# EAGLE design uprom2-2l (EAGLE 9.6.1)
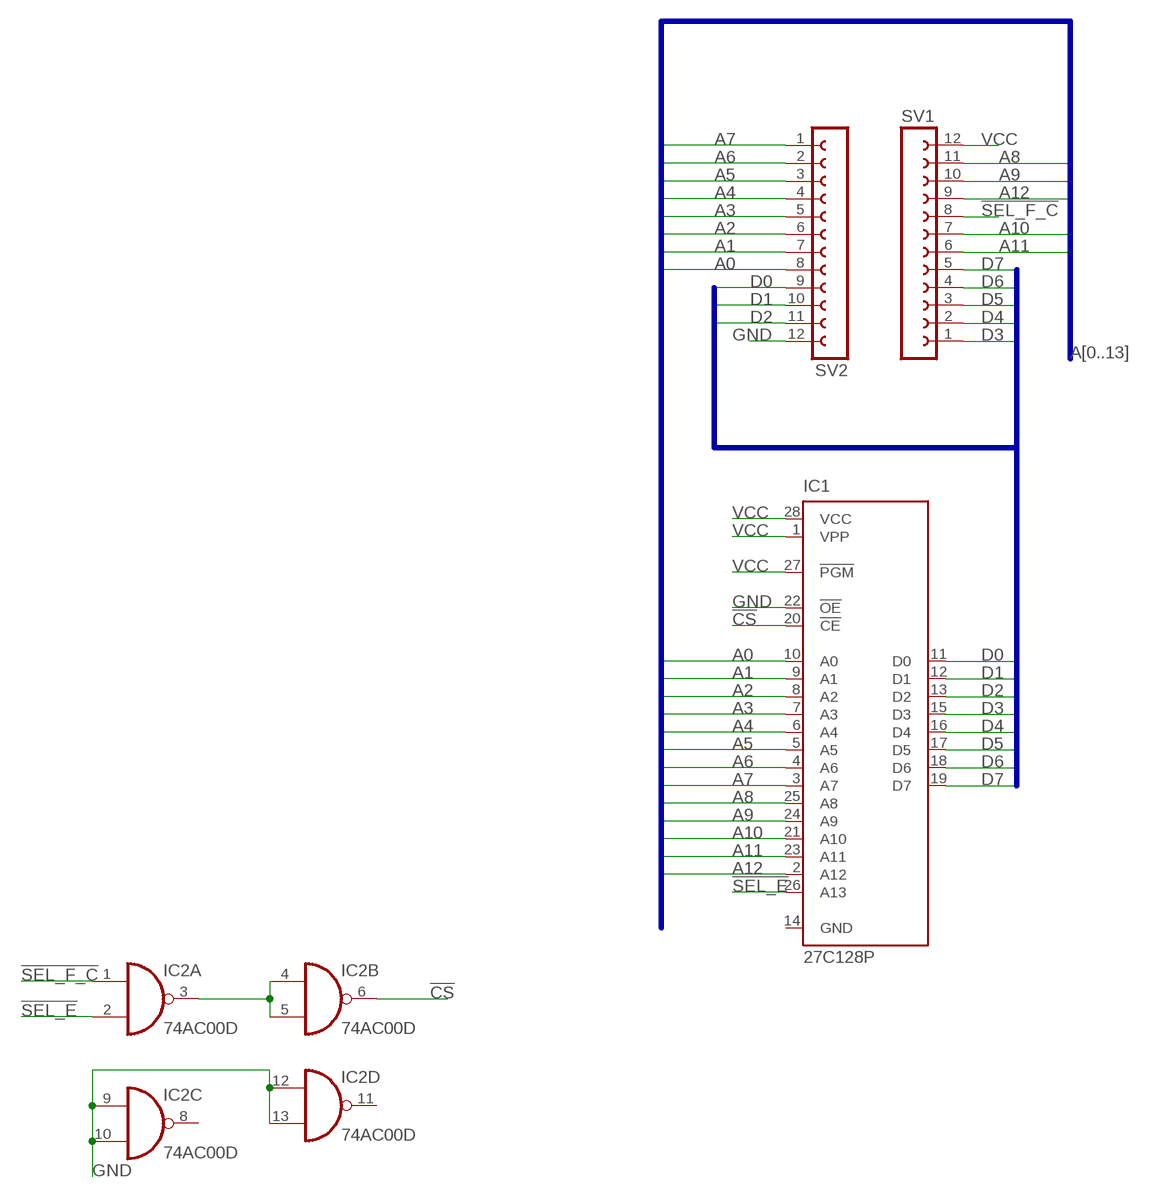
[diagram p0: schematic, sheet 1]

## Parts
IC1  27C128P  [DIL28-6]
IC2  74AC00D  [SO14]
SV1  FE12-1  [FE12]
SV2  FE12-1  [FE12]

## Nets
!CS: IC1.20(!CE) IC2.6(B:O)
!SEL_E: IC1.26(A13) IC2.2(A:I1)
!SEL_F_C: IC2.1(A:I0) SV1.8
A0: IC1.10(A0) SV2.8
A1: IC1.9(A1) SV2.7
A2: IC1.8(A2) SV2.6
A3: IC1.7(A3) SV2.5
A4: IC1.6(A4) SV2.4
A5: IC1.5(A5) SV2.3
A6: IC1.4(A6) SV2.2
A7: IC1.3(A7) SV2.1
A8: IC1.25(A8) SV1.11
A9: IC1.24(A9) SV1.10
A10: IC1.21(A10) SV1.7
A11: IC1.23(A11) SV1.6
A12: IC1.2(A12) SV1.9
D0: IC1.11(D0) SV2.9
D1: IC1.12(D1) SV2.10
D2: IC1.13(D2) SV2.11
D3: IC1.15(D3) SV1.1
D4: IC1.16(D4) SV1.2
D5: IC1.17(D5) SV1.3
D6: IC1.18(D6) SV1.4
D7: IC1.19(D7) SV1.5
GND: IC1.22(!OE) IC2.9(C:I0) IC2.10(C:I1) IC2.12(D:I0) IC2.13(D:I1) SV2.12
N$4: IC2.3(A:O) IC2.4(B:I0) IC2.5(B:I1)
VCC: IC1.1(VPP) IC1.27(!PGM) IC1.28(VCC) SV1.12
Unconnected: IC2.8(C:O) IC2.11(D:O)

## Buses
A[0..13]
D[0..7]

## Power pins joined to a net without a drawn wire
GND: IC1.14(GND) IC2.7(P:GND)
VCC: IC2.14(P:VCC)

## Library data of the parts
IC1 = microchip:27*128: CMOS EPROM 128 K (16 K x 8); OC_FARNELL: unknown; OC_NEWARK: unknown
IC2 = 74xx-eu:74*00: Quad 2-input NAND gate
SV1 SV2 = con-lsta:FE12-1: FEMALE HEADER; OC_FARNELL: unknown; OC_NEWARK: unknown

## Board
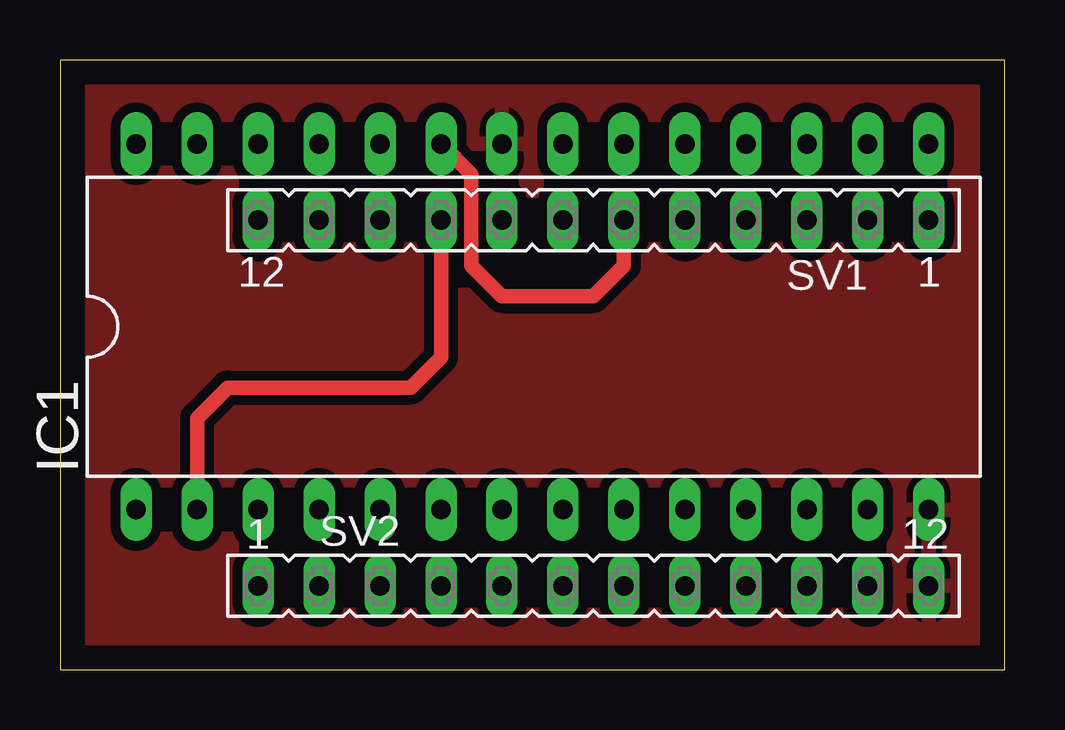
[diagram p1: board, top side]
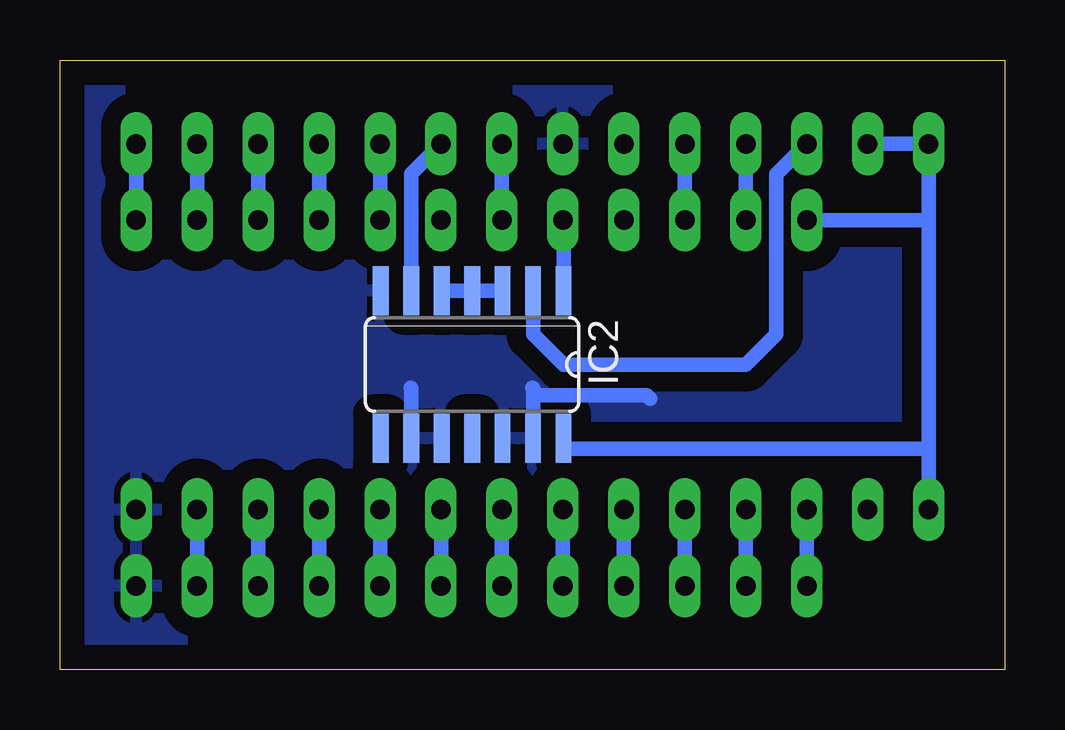
[diagram p2: board, bottom side, seen from below]

Size 39.37 x 25.4 mm. Coordinates in mm from the lower left corner, seen from the top.
Outline: 0,0 39.37,0 39.37,25.4 0,25.4 0,0
Copper layers (1*16): Top 0.035mm / dielectric 1.5mm / Bottom 0.035mm
Design rules "default": minimum track width 6mil, minimum drill 0.35mm, track to track 6mil, track to pad 6mil, pad to pad 6mil, via to via 6mil, smd to smd 6mil, copper to edge 40mil, drill to drill 6mil, minimum pad ring 10mil, minimum via ring 8mil, stop-mask expansion 4mil, vias tented up to drill 0mil, thermal gap 10mil

### Footprints (pad centres in the part's own frame; a part is rotated, then mirrored left to right if it is on the bottom)
DIL28-6 = drill 0.813 long: 1 -16.51,-7.62; 2 -13.97,-7.62; 3 -11.43,-7.62; 4 -8.89,-7.62; 5 -6.35,-7.62; 6 -3.81,-7.62; 7 -1.27,-7.62; 8 1.27,-7.62; 9 3.81,-7.62; 10 6.35,-7.62; 11 8.89,-7.62; 12 11.43,-7.62; 13 13.97,-7.62; 14 16.51,-7.62; 15 16.51,7.62; 16 13.97,7.62; 17 11.43,7.62; 18 8.89,7.62; 19 6.35,7.62; 20 3.81,7.62; 21 1.27,7.62; 22 -1.27,7.62; 23 -3.81,7.62; 24 -6.35,7.62; 25 -8.89,7.62; 26 -11.43,7.62; 27 -13.97,7.62; 28 -16.51,7.62
SO14 = smd 0.66 x 2.032: 1 -3.81,-3.073; 2 -2.54,-3.073; 3 -1.27,-3.073; 4 0,-3.073; 5 1.27,-3.073; 6 2.54,-3.073; 7 3.81,-3.073; 8 3.81,3.073; 9 2.54,3.073; 10 1.27,3.073; 11 0,3.073; 12 -1.27,3.073; 13 -2.54,3.073; 14 -3.81,3.073
FE12 = drill 0.813 long: 1 -13.97,0; 2 -11.43,0; 3 -8.89,0; 4 -6.35,0; 5 -3.81,0; 6 -1.27,0; 7 1.27,0; 8 3.81,0; 9 6.35,0; 10 8.89,0; 11 11.43,0; 12 13.97,0

### Placement (x,y rotation side)
IC1  19.69,14.29 0 top
IC2  22.2,12.71 180 bottom
SV1  22.23,18.73 180 top
SV2  22.23,3.49 0 top

### Tracks (layer width: path | path; a pad name or v marks a point on that pad's centre or on a via)
!CS
  Bottom 0.61: IC2.6 24.74,20.66 IC1.20
!SEL_E
  Bottom 0.61: 19.69,15.76 IC2.2 19.66,13.97 18.39,12.7 10.8,12.7 9.52,13.97 9.52,20.64 IC1.26
!SEL_F_C
  Bottom 0.61: IC2.1 18.39,18.71 SV1.8
A0
  Bottom 0.61: IC1.10 SV2.8
A1
  Bottom 0.61: SV2.7 IC1.9
A2
  Bottom 0.61: IC1.8 SV2.6
A3
  Bottom 0.61: SV2.5 IC1.7
A4
  Bottom 0.61: IC1.6 SV2.4
A5
  Bottom 0.61: SV2.3 IC1.5
A6
  Bottom 0.61: IC1.4 SV2.2
A7
  Bottom 0.61: SV2.1 IC1.3
A8
  Bottom 0.61: IC1.25 SV1.11
A9
  Bottom 0.61: SV1.10 IC1.24
A10
  Bottom 0.61: IC1.21 SV1.7
A11
  Top 0.61: IC1.23 17.14,20.64 17.14,16.83 18.41,15.56 22.23,15.56 23.49,16.83 SV1.6
A12
  Top 0.61: IC1.2 5.71,10.48 6.98,11.75 14.6,11.75 15.88,13.02 SV1.9
D0
  Bottom 0.61: SV2.9 IC1.11
D1
  Bottom 0.61: IC1.12 SV2.10
D2
  Bottom 0.61: SV2.11 IC1.13
D3
  Bottom 0.61: SV1.1 IC1.15
D4
  Bottom 0.61: IC1.16 SV1.2
D5
  Bottom 0.61: SV1.3 IC1.17
D6
  Bottom 0.61: IC1.18 SV1.4
D7
  Bottom 0.61: SV1.5 IC1.19
GND
  Bottom 0.61: IC2.13 19.66,11.43 | 19.66,11.43 19.66,11.72 19.69,11.75 | IC2.9 24.74,11.72 24.77,11.75 | 14.77,11.28 14.92,11.43 19.66,11.43
  pour Bottom (isolate 0.813): -0.63,0.15 -0.63,25.4 38.1,25.4 38.1,0.15
  pour Top (isolate 0.406): -1.91,25.72 40,25.72 40,0 -1.91,0
N$4
  Bottom 0.61: IC2.5 IC2.4 IC2.3
VCC
  Bottom 0.61: IC1.27 IC1.28 3.17,18.73 | 3.17,9.21 3.17,18.73 | SV1.12 3.17,18.73 | IC2.14 18.39,9.32 18.27,9.21 3.17,9.21 | 3.17,9.21 IC1.1